# Altium schematic sheet DDS_AD9910_and_uC.SchDoc
size 594 x 420 mm; SheetNumber: 4; SheetTotal: 7
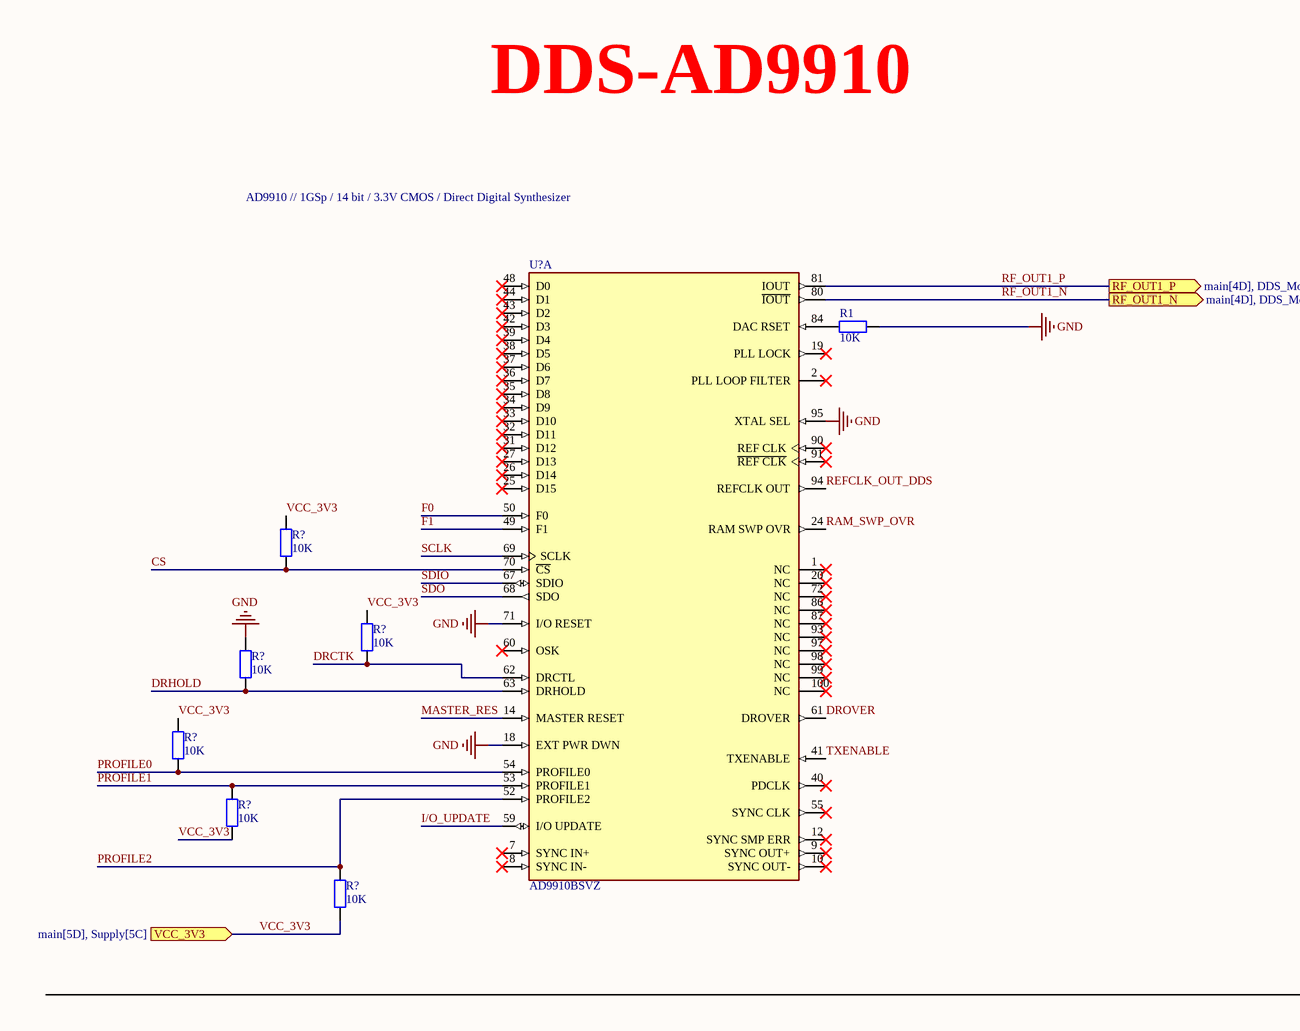
[diagram p0: DDS_AD9910_and_uC.SchDoc, left]
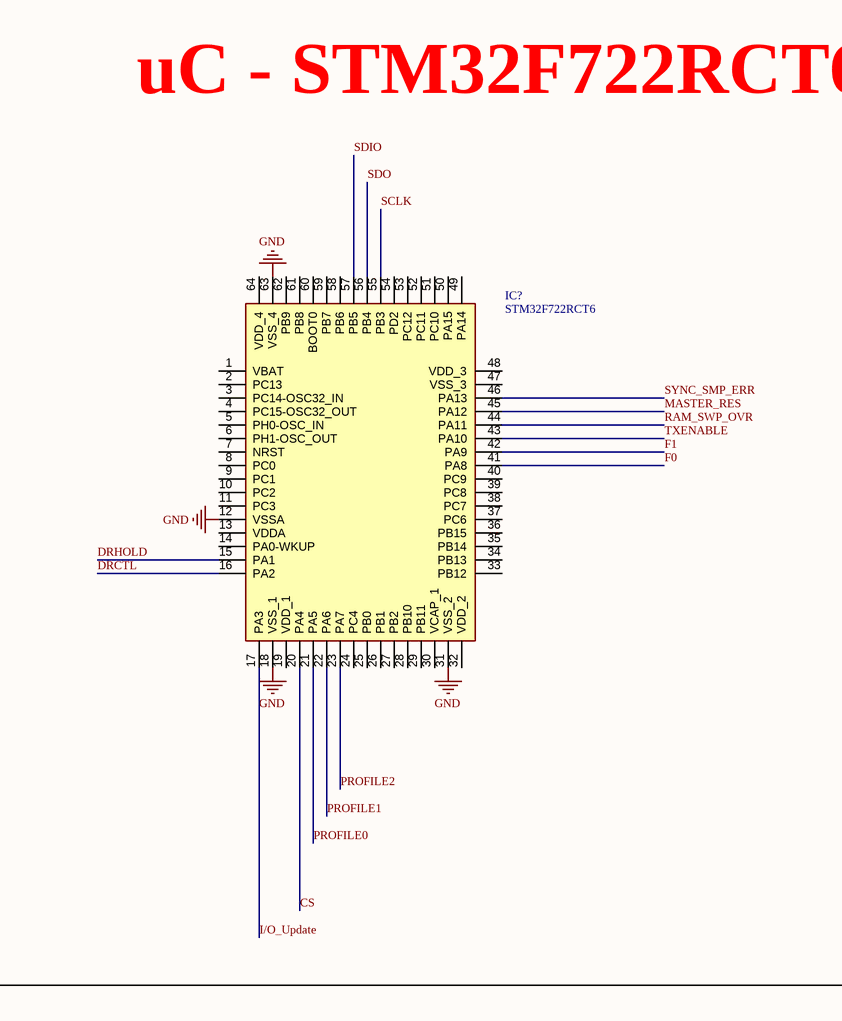
[diagram p1: DDS_AD9910_and_uC.SchDoc, right]

## Parts
(Parts that share a designator on the sheet are numbered #1, #2 ... from top to bottom, then left to right.)
IC?  STM32F722RCT6  [QFP50P1200X1200X160-64N]
R1  value 10K  [AXIAL-0.4]
R?#1  value 10K  [AXIAL-0.4]
R?#2  value 10K  [AXIAL-0.4]
R?#3  value 10K  [AXIAL-0.4]
R?#4  value 10K  [AXIAL-0.4]
R?#5  value 10K  [AXIAL-0.4]
R?#6  value 10K  [AXIAL-0.4]
U?  AD9910BSVZ  [FP-SV-100-4-IPC_A]  (part A of 2)

## Ports
RF_OUT1_N (out, see main[4D], DDS_Modul_Multiplier[1C]), RF_OUT1_P (out, see main[4D], DDS_Modul_Multiplier[1B]), VCC_3V3 (in, see main[5D], Supply[5C])

## Nets
GND: IC?.12(VSSA) IC?.18(VSS_1) IC?.31(VSS_2) IC?.63(VSS_4) R1.2 R?#3.2 U?.18(EXT_PWR_DWN) U?.71(I/O_RESET) U?.95(XTAL_SEL)
CS: IC?.20(PA4) R?#1.1 U?.70(~{CS})
DRCTK: R?#2.1 U?.62(DRCTL)
DRCTL: IC?.16(PA2)
DRHOLD: IC?.15(PA1) R?#3.1 U?.63(DRHOLD)
DROVER: U?.61(DROVER)
F0: IC?.41(PA8) U?.50(F0)
F1: IC?.42(PA9) U?.49(F1)
I/O_UPDATE: IC?.17(PA3) U?.59(I/O_UPDATE)
MASTER_RES: IC?.45(PA12) U?.14(MASTER_RESET)
PROFILE0: IC?.21(PA5) R?#4.1 U?.54(PROFILE0)
PROFILE1: IC?.22(PA6) R?#5.2 U?.53(PROFILE1)
PROFILE2: IC?.23(PA7) R?#6.2 U?.52(PROFILE2)
RAM_SWP_OVR: IC?.44(PA11) U?.24(RAM_SWP_OVR)
REFCLK_OUT_DDS: U?.94(REFCLK_OUT)
RF_OUT1_N: U?.80(~{IOUT}) ; port RF_OUT1_N
RF_OUT1_P: U?.81(IOUT) ; port RF_OUT1_P
SCLK: IC?.55(PB3) U?.69(SCLK)
SDIO: IC?.57(PB5) U?.67(SDIO)
SDO: IC?.56(PB4) U?.68(SDO)
SYNC_SMP_ERR: IC?.46(PA13)
TXENABLE: IC?.43(PA10) U?.41(TXENABLE)
VCC_3V3: R?#1.2 R?#2.2 R?#4.2 R?#5.1 R?#6.1 ; port VCC_3V3
NetR1_1: R1.1 U?.84(DAC_RSET)

Not connected (* = marked no-connect by the designer): IC? 1(VBAT) 2(PC13) 3(PC14-OSC32_IN) 4(PC15-OSC32_OUT) 5(PH0-OSC_IN) 6(PH1-OSC_OUT) 7(NRST) 8(PC0) 9(PC1) 10(PC2) 11(PC3) 13(VDDA) 14(PA0-WKUP) 19(VDD_1) 24(PC4) 25(PB0) 26(PB1) 27(PB2) 28(PB10) 29(PB11) 30(VCAP_1) 32(VDD_2) 33(PB12) 34(PB13) 35(PB14) 36(PB15) 37(PC6) 38(PC7) 39(PC8) 40(PC9) 47(VSS_3) 48(VDD_3) 49(PA14) 50(PA15) 51(PC10) 52(PC11) 53(PC12) 54(PD2) 58(PB6) 59(PB7) 60(BOOT0) 61(PB8) 62(PB9) 64(VDD_4); U? 1(NC)* 2(PLL_LOOP_FILTER)* 7(SYNC_IN+)* 8(SYNC_IN-)* 9(SYNC_OUT+)* 10(SYNC_OUT-)* 12(SYNC_SMP_ERR)* 19(PLL_LOCK)* 20(NC)* 25(D15)* 26(D14)* 27(D13)* 31(D12)* 32(D11)* 33(D10)* 34(D9)* 35(D8)* 36(D7)* 37(D6)* 38(D5)* 39(D4)* 40(PDCLK)* 42(D3)* 43(D2)* 44(D1)* 48(D0)* 55(SYNC_CLK)* 60(OSK)* 72(NC)* 86(NC)* 87(NC)* 90(REF_CLK)* 91(~{REF_CLK})* 93(NC)* 97(NC)* 98(NC)* 99(NC)* 100(NC)*

## Notes on the sheet
- DDS-AD9910
- uC - STM32F722RCT6
- AD9910 // 1GSp / 14 bit / 3.3V CMOS / Direct Digital Synthesizer
- DWG NO:
- REV:
- THIS DOCUMENT AND THE DATA DISCLOSED HEREIN OR
- HEREWITH IS THE PROPERTY OF ALTIUM LIMITED AND MAY
- BE FREELY DISTRIBUTED IN WHOLE. NO RIGHTS ARE
- RESERVED OR EXPRESS OR IMPLIED WARANTEE GIVEN.
- REVISION
- DESCRIPTION
- DATE
- APPROVED
- ENG:
- APPROVALS
- PROJECT
- DSN:
- CHK:
- REFERENCE DOCUMENTS
- PROJECT REVISION:
- TITLE
- DOCUMENT REVISION:
- DESIGN ITEM:
- BOM:
- FAB DWG:
- PCB DWG:
- ASSY DWG:
- SCALE:
- A2
- SIZE
- CAGE CODE
- FILE NAME
- DWG NO.
- SHEET
- OF
- REV

## Library data of the parts
IC? = STM32F722RCT6: Integrated Circuit; Manufacturer_Name: STMicroelectronics; Datasheet Link: https://www.st.com/resource/en/datasheet/stm32f722rc.pdf; Height: 1.6mm; Manufacturer_Part_Number: STM32F722RCT6; Mouser Part Number: 511-STM32F722RCT6; Mouser Price/Stock: https://www.mouser.co.uk/ProductDetail/STMicroelectronics/STM32F722RCT6?qs=Mv7BduZupUiR0Y60TnwX8g%3D%3D; Arrow Part Number: STM32F722RCT6; Arrow Price/Stock: https://www.arrow.com/en/products/stm32f722rct6/stmicroelectronics?region=nac
R1 R?#1-R?#6 = Res2: Resistor; Published: 8-Jun-2000; LatestRevisionDate: 17-Jul-2002; LatestRevisionNote: Re-released for DXP Platform.; PackageReference: AXIAL-0.4; Publisher: Altium Limited; PackageDescription: Axial Device, Thru-Hole; 2 Leads; 0.4 in Pin Spacing
U? = CMP-0293-00026-2: IC DDS 1GHZ 14BIT 100TQFP; Max Supply Voltage: 1.89V; Operating Supply Voltage: 1.8V; Max Supply Current: 110mA; Number of Outputs: 1; Conversion Rate: 1000000KS/s; Resolution: 14b; Nominal Supply Current: 29mA; Min Supply Voltage: 1.71V; Mount: Surface Mount; Case/Package: TQFP; Number of Pins: 100; Frequency: 1GHz; Width: 14mm; Length: 14mm; Contact Plating: Tin; RoHS Compliant: Yes; Number of Converters: 1; Height: 1mm; Packaging: Tray; REACH SVHC: No SVHC; Max Operating Temperature: 85°C; Number of D/A Converters: 1; Lead Free: Contains Lead; Package Quantity: 90; Min Operating Temperature: -40°C